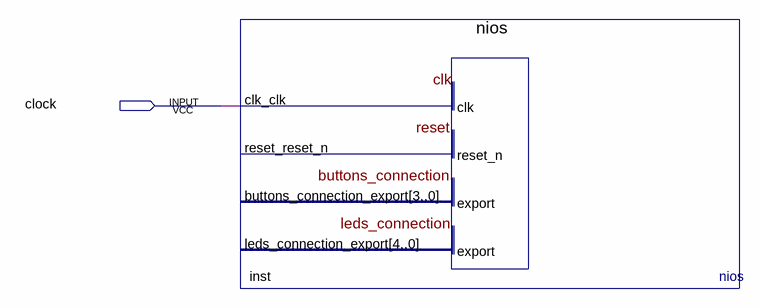
[diagram p0: schematic sheet]
// Quartus schematic processor.bdf as structural Verilog: 1 symbols, 1 pins
module processor (
  input  clock
);

  nios inst (.clk_clk(clock));  // open: reset_reset_n, buttons_connection_export, leds_connection_export
endmodule
